# EAGLE design fensterkontakte (EAGLE 7.1.0)
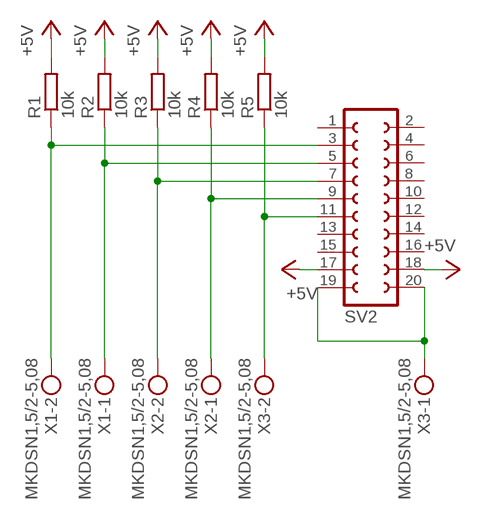
[diagram p0: schematic, sheet 1]

## Parts
R1  10k  R-EU_M0805  [M0805]
R2  10k  R-EU_M0805  [M0805]
R3  10k  R-EU_M0805  [M0805]
R4  10k  R-EU_M0805  [M0805]
R5  10k  R-EU_M0805  [M0805]
SV2  FE10-2  [FE10-2]
X1  MKDSN1,5/2-5,08  [MKDSN1,5/2-5,08]
X2  MKDSN1,5/2-5,08  [MKDSN1,5/2-5,08]
X3  MKDSN1,5/2-5,08  [MKDSN1,5/2-5,08]

## Nets
+5V: R1.2 R2.2 R3.2 R4.2 R5.2 SV2.17 SV2.18
GND: SV2.19 SV2.20 X3.1
N$1: R1.1 SV2.3 X1.2
N$2: R2.1 SV2.5 X1.1
N$3: R3.1 SV2.7 X2.2
N$4: R4.1 SV2.9 X2.1
N$5: R5.1 SV2.11 X3.2
Unconnected: SV2.1 SV2.2 SV2.4 SV2.6 SV2.8 SV2.10 SV2.12 SV2.13 SV2.14 SV2.15 SV2.16

## Library data of the parts
R1-R5 = rcl:R-EU_: RESISTOR, European symbol
SV2 = con-lsta:FE10-2: FEMALE HEADER; OC_FARNELL: unknown; OC_NEWARK: unknown
X1-X3 = con-phoenix-508:MKDSN1,5/2-5,08: MKDSN 1,5/ 2-5,08 Printklemme Nennstrom: 13,5 A Nennspannung: 250 V Rastermaß: 5,08 mm Polzahl: 2 Anschlussart: Schraubanschluss Montage: Löten Anschlussrichtung Leiter/Platine: 0 ° Artikelnummer: 1729128 Source: http://eshop.phoenixcontact.com .. 1729128.pdf

## Board
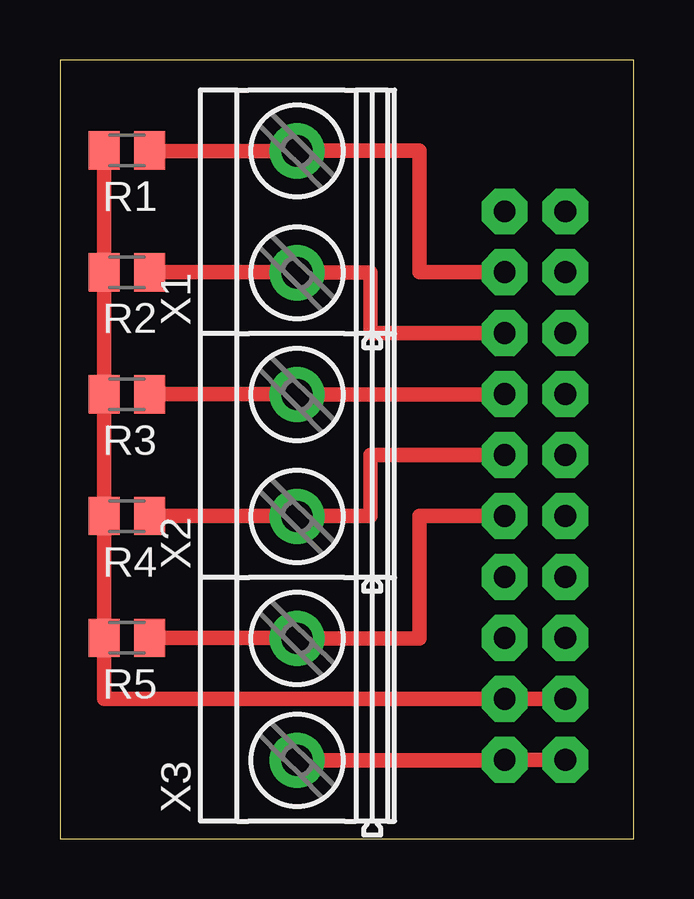
[diagram p1: board, top side]
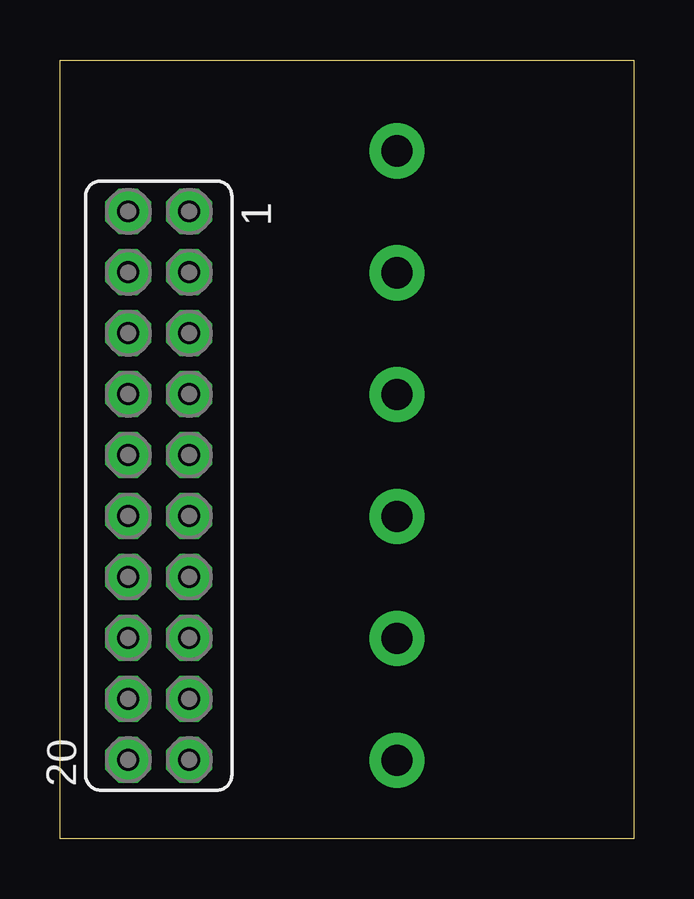
[diagram p2: board, bottom side, seen from below]

Size 23.93 x 32.47 mm. Coordinates in mm from the lower left corner, seen from the top.
Outline: 0,0 23.93,0 23.93,32.47 0,32.47 0,0
Copper layers (1*16): Top 0.035mm / dielectric 1.5mm / Bottom 0.035mm
Design rules "default *": minimum track width 10mil, minimum drill 24mil, track to track 8mil, track to pad 8mil, pad to pad 8mil, via to via 8mil, smd to smd 8mil, copper to edge 40mil, drill to drill 8mil, minimum pad ring 0.5mm, minimum via ring 0.5mm, stop-mask expansion 4mil, vias tented up to drill 0mil, thermal gap 10mil

### Footprints (pad centres in the part's own frame; a part is rotated, then mirrored left to right if it is on the bottom)
M0805 = smd 1.3 x 1.6: 1 -0.95,0; 2 0.95,0
FE10-2 = drill 0.914 octagon: 1 -11.43,1.27; 2 -11.43,-1.27; 3 -8.89,1.27; 4 -8.89,-1.27; 5 -6.35,1.27; 6 -6.35,-1.27; 7 -3.81,1.27; 8 -3.81,-1.27; 9 -1.27,1.27; 10 -1.27,-1.27; 11 1.27,1.27; 12 1.27,-1.27; 13 3.81,1.27; 14 3.81,-1.27; 15 6.35,1.27; 16 6.35,-1.27; 17 8.89,1.27; 18 8.89,-1.27; 19 11.43,1.27; 20 11.43,-1.27
MKDSN1,5/2-5,08 = drill 1.3 pad 2: 1 -2.561,0.025; 2 2.519,0.025

### Placement (x,y rotation side)
R1  2.79,28.7 180 top
R2  2.79,23.62 180 top
R3  2.79,18.54 180 top
R4  2.79,13.46 180 top
R5  2.79,8.38 180 top
SV2  19.81,14.73 270 bottom
X1  9.91,26.16 90 top
X2  9.91,16 90 top
X3  9.91,5.84 90 top

### Tracks (layer width: path | path; a pad name or v marks a point on that pad's centre or on a via)
+5V
  Top 0.61: SV2.18 SV2.17 1.84,5.84 R5.2 R4.2 R3.2 R2.2 R1.2
GND
  Top 0.61: X3.1 18.54,3.28 SV2.19 SV2.20
N$1
  Top 0.61: SV2.3 14.99,23.62 14.99,28.7 9.88,28.7 X1.2 3.74,28.68 R1.1
N$2
  Top 0.61: R2.1 9.88,23.62 X1.1 12.95,23.6 12.95,21.08 SV2.5
N$3
  Top 0.61: R3.1 9.88,18.54 X2.2 18.54,18.52 SV2.7
N$4
  Top 0.61: SV2.9 12.95,16 12.95,13.46 9.88,13.46 | R4.1 9.88,13.46 | 9.88,13.46 X2.1
N$5
  Top 0.61: R5.1 9.88,8.38 X3.2 14.99,8.36 14.99,13.46 SV2.11